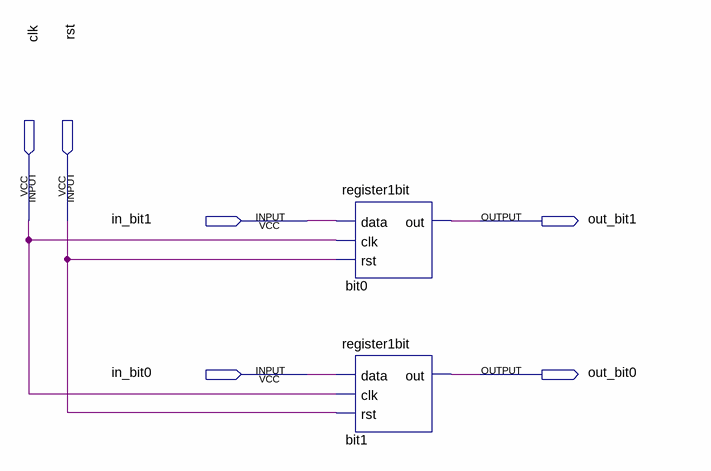
[diagram p0: schematic sheet]
// Quartus schematic register2bit.bdf as structural Verilog: 2 symbols, 6 pins
module register2bit (
  input  clk,
  input  rst,
  input  in_bit1,
  input  in_bit0,
  output out_bit1,
  output out_bit0
);

  register1bit bit0 (.data(in_bit1), .clk(clk), .rst(rst), .out(out_bit1));
  register1bit bit1 (.data(in_bit0), .clk(clk), .rst(rst), .out(out_bit0));
endmodule
